# EAGLE design ToggleTone (EAGLE 7.5.0)
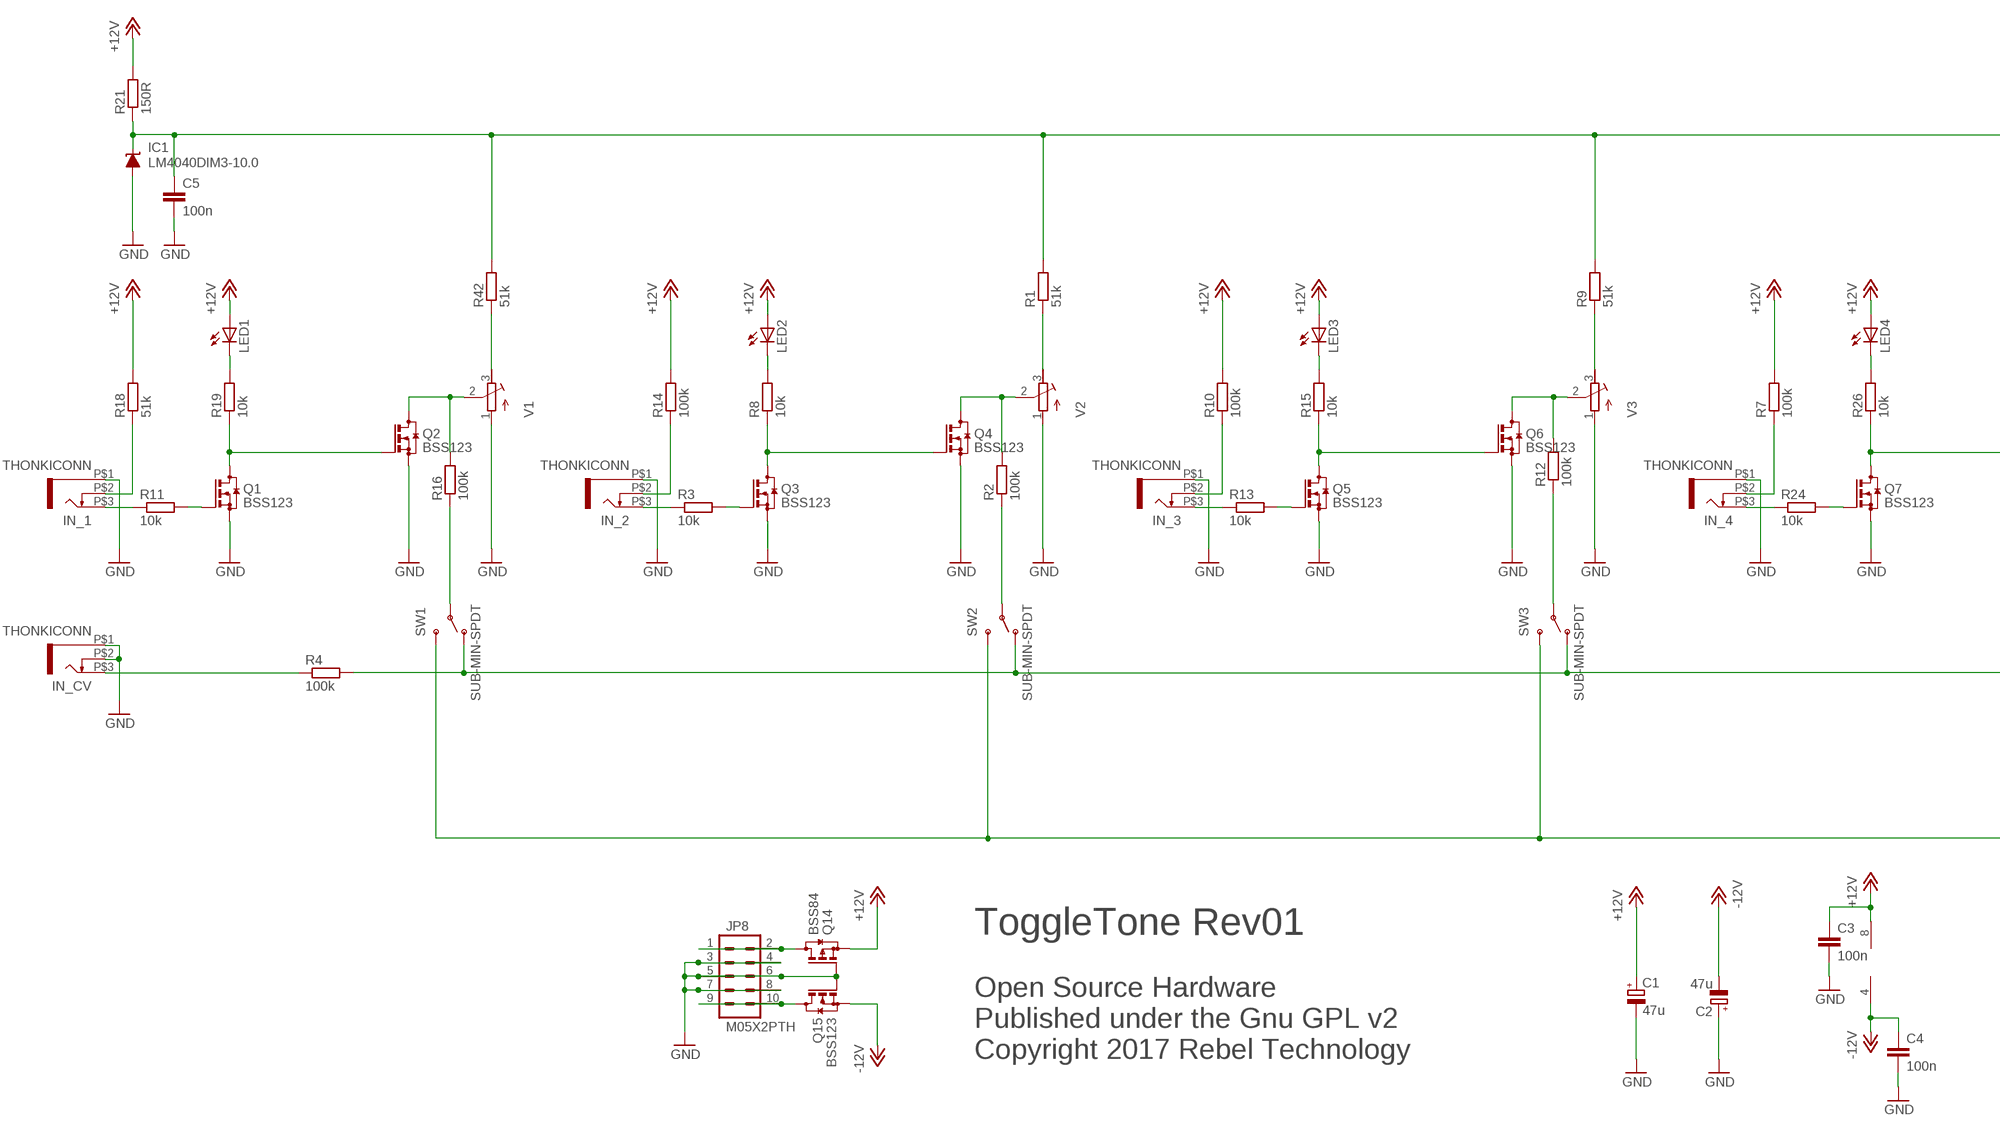
[diagram p0: schematic, sheet 1, part 1 of 2]
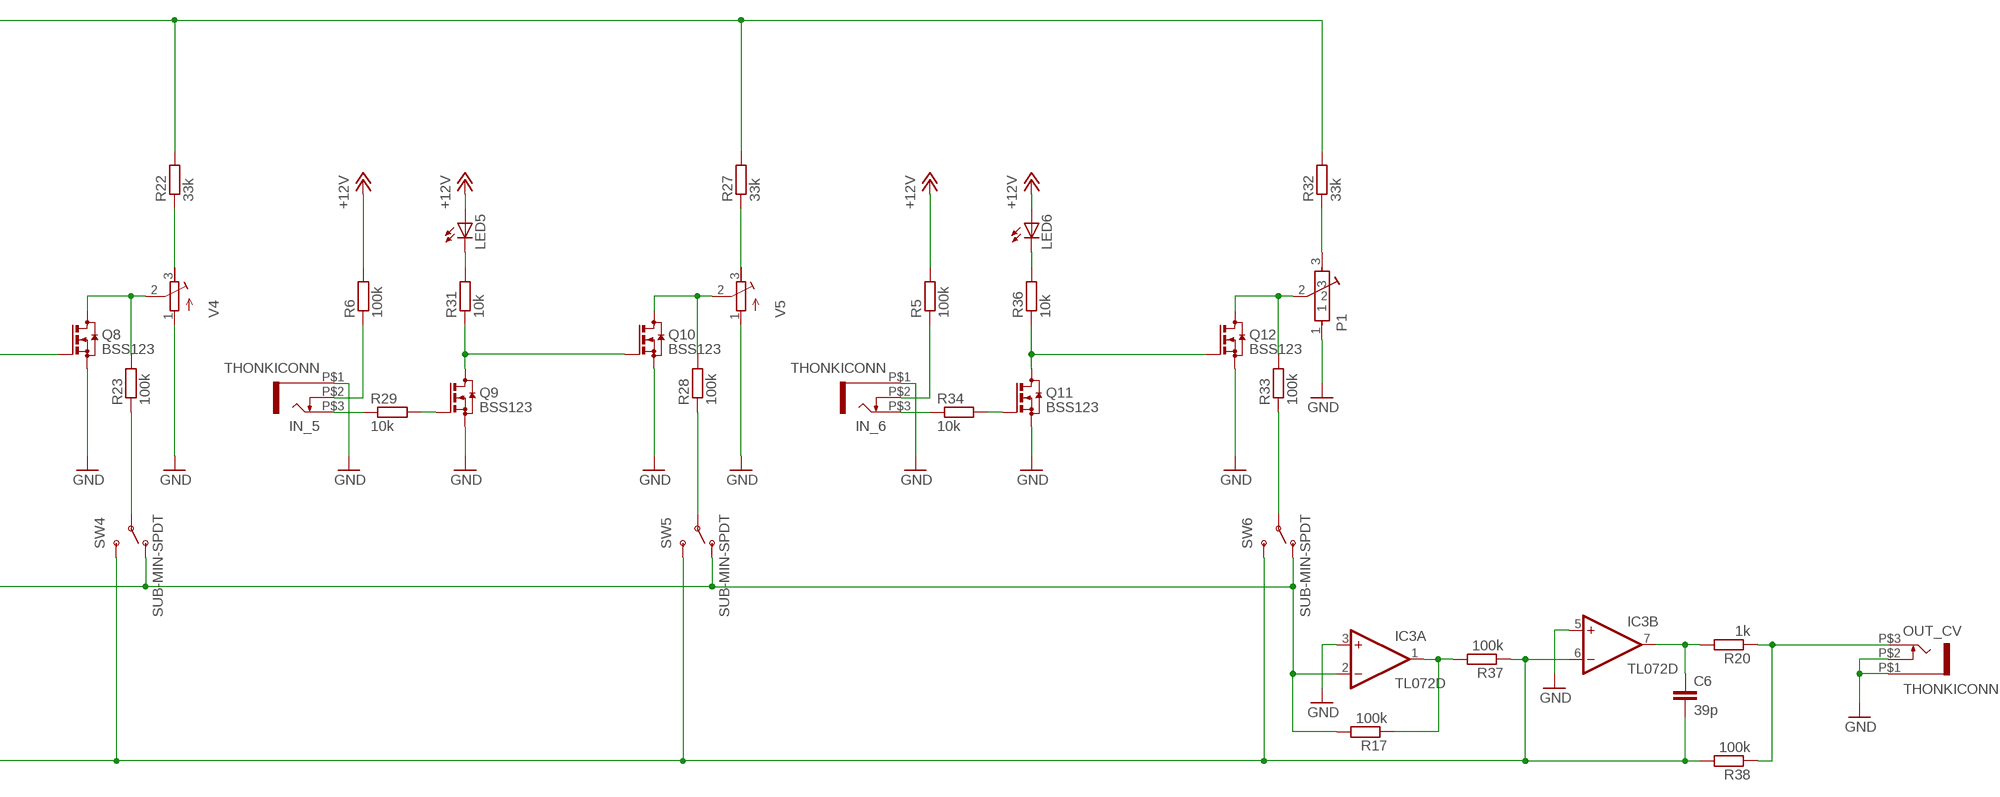
[diagram p1: schematic, sheet 1, part 2 of 2]

## Parts
C1  47u  CPOL-EU153CLV-0505  [CPOL-5]
C2  47u  CPOL-EU153CLV-0505  [CPOL-5]
C3  100n  C-EUC0603  [C0603]
C4  100n  C-EUC0603  [C0603]
C5  100n  C-EUC0603  [C0603]
C6  39p  C-EUC0603  [C0603]
IC1  LM4040DIM3-10.0  LM4041A12DBZ  [DBZ_R-PDSO-G3]
IC3  TL072D  [SO08]
IN_1  THONKICONN  [THONKICONN]
IN_2  THONKICONN  [THONKICONN]
IN_3  THONKICONN  [THONKICONN]
IN_4  THONKICONN  [THONKICONN]
IN_5  THONKICONN  [THONKICONN]
IN_6  THONKICONN  [THONKICONN]
IN_CV  THONKICONN  [THONKICONN]
JP8  M05X2PTH  [AVR_ICSP]
LED1  LED3MM  [LED3MM]
LED2  LED3MM  [LED3MM]
LED3  LED3MM  [LED3MM]
LED4  LED3MM  [LED3MM]
LED5  LED3MM  [LED3MM]
LED6  LED3MM  [LED3MM]
OUT_CV  THONKICONN  [THONKICONN]
P1  POT-ALPS-RK09L1140  [POT-ALPS-RK09L1140]
Q1  BSS123  [SOT23]
Q2  BSS123  [SOT23]
Q3  BSS123  [SOT23]
Q4  BSS123  [SOT23]
Q5  BSS123  [SOT23]
Q6  BSS123  [SOT23]
Q7  BSS123  [SOT23]
Q8  BSS123  [SOT23]
Q9  BSS123  [SOT23]
Q10  BSS123  [SOT23]
Q11  BSS123  [SOT23]
Q12  BSS123  [SOT23]
Q14  BSS84  [SOT23]
Q15  BSS123  [SOT23]
R1  51k  R-EU_0603  [0603]
R2  100k  R-EU_0603  [0603]
R3  10k  R-EU_0603  [0603]
R4  100k  R-EU_0603  [0603]
R5  100k  R-EU_0603  [0603]
R6  100k  R-EU_0603  [0603]
R7  100k  R-EU_0603  [0603]
R8  10k  R-EU_0603  [0603]
R9  51k  R-EU_0603  [0603]
R10  100k  R-EU_0603  [0603]
R11  10k  R-EU_0603  [0603]
R12  100k  R-EU_0603  [0603]
R13  10k  R-EU_0603  [0603]
R14  100k  R-EU_0603  [0603]
R15  10k  R-EU_0603  [0603]
R16  100k  R-EU_0603  [0603]
R17  100k  R-EU_0603  [0603]
R18  51k  R-EU_0603  [0603]
R19  10k  R-EU_0603  [0603]
R20  1k  R-EU_0603  [0603]
R21  150R  R-EU_0603  [0603]
R22  33k  R-EU_0603  [0603]
R23  100k  R-EU_0603  [0603]
R24  10k  R-EU_0603  [0603]
R26  10k  R-EU_0603  [0603]
R27  33k  R-EU_0603  [0603]
R28  100k  R-EU_0603  [0603]
R29  10k  R-EU_0603  [0603]
R31  10k  R-EU_0603  [0603]
R32  33k  R-EU_0603  [0603]
R33  100k  R-EU_0603  [0603]
R34  10k  R-EU_0603  [0603]
R36  10k  R-EU_0603  [0603]
R37  100k  R-EU_0603  [0603]
R38  100k  R-EU_0603  [0603]
R42  51k  R-EU_0603  [0603]
SW1  SUB-MIN-SPDT  [SUB-MIN-SPDT]
SW2  SUB-MIN-SPDT  [SUB-MIN-SPDT]
SW3  SUB-MIN-SPDT  [SUB-MIN-SPDT]
SW4  SUB-MIN-SPDT  [SUB-MIN-SPDT]
SW5  SUB-MIN-SPDT  [SUB-MIN-SPDT]
SW6  SUB-MIN-SPDT  [SUB-MIN-SPDT]
V1  R-TRIMM64W  [RTRIM64W]
V2  R-TRIMM64W  [RTRIM64W]
V3  R-TRIMM64W  [RTRIM64W]
V4  R-TRIMM64W  [RTRIM64W]
V5  R-TRIMM64W  [RTRIM64W]

## Nets
+12V: C1.+ C3.1 IC3.8(P:V+) LED1.A LED2.A LED3.A LED4.A LED5.A LED6.A Q14.2(S) R5.2 R6.2 R7.2 R10.2 R14.2 R18.2 R21.2
-12V: C2.- C4.1 IC3.4(P:V-) Q15.2(S)
GND: C1.- C2.+ C3.2 C4.2 C5.2 IC1.2(A) IC3.3(A:+IN) IC3.5(B:+IN) IN_1.P$1 IN_2.P$1 IN_3.P$1 IN_4.P$1 IN_5.P$1 IN_6.P$1 IN_CV.P$1 IN_CV.P$2 JP8.3 JP8.4 JP8.5 JP8.6 JP8.7 JP8.8 OUT_CV.P$1 OUT_CV.P$2 P1.1 Q1.2(S) Q2.2(S) Q3.2(S) Q4.2(S) Q5.2(S) Q6.2(S) Q7.2(S) Q8.2(S) Q9.2(S) Q10.2(S) Q11.2(S) Q12.2(S) Q14.1(G) Q15.1(G) V1.1(A) V2.1(A) V3.1(A) V4.1(A) V5.1(A)
N$1: LED1.K(C) R19.2
N$2: OUT_CV.P$3 R20.1 R38.1
N$3: IN_1.P$3 R11.1
N$4: JP8.9 JP8.10 Q15.3(D)
N$5: R1.1 V2.3(E)
N$6: IN_CV.P$3 R4.1
N$7: Q2.3(D) R16.2 V1.2(S)
N$8: LED3.K(C) R15.2
N$9: LED4.K(C) R26.2
N$10: LED5.K(C) R31.2
N$11: LED6.K(C) R36.2
N$13: Q3.1(G) R3.2
N$14: LED2.K(C) R8.2
N$15: IN_1.P$2 R18.1
N$16: Q3.3(D) Q4.1(G) R8.1
N$17: IN_2.P$3 R3.1
N$18: Q4.3(D) R2.2 V2.2(S)
N$19: C5.1 IC1.1(C) R1.2 R9.2 R21.1 R22.2 R27.2 R32.2 R42.2
N$20: Q1.1(G) R11.2
N$21: P1.3 R32.1
N$22: IN_6.P$2 R5.1
N$23: R9.1 V3.3(E)
N$24: R12.1 SW3.2(P)
N$25: Q1.3(D) Q2.1(G) R19.1
N$26: Q5.1(G) R13.2
N$27: R16.1 SW1.2(P)
N$28: Q5.3(D) Q6.1(G) R15.1
N$29: IN_3.P$3 R13.1
N$30: Q6.3(D) R12.2 V3.2(S)
N$31: R2.1 SW2.2(P)
N$32: R22.1 V4.3(E)
N$33: C6.1 IC3.7(B:OUT) R20.2
N$34: Q7.1(G) R24.2
N$35: IC3.1(A:OUT) R17.1 R37.2
N$36: R23.1 SW4.2(P)
N$37: Q7.3(D) Q8.1(G) R26.1
N$38: IN_4.P$3 R24.1
N$39: Q8.3(D) R23.2 V4.2(S)
N$40: R28.1 SW5.2(P)
N$41: R33.1 SW6.2(P)
N$42: IN_5.P$2 R6.1
N$43: R27.1 V5.3(E)
N$44: R42.1 V1.3(E)
N$45: Q9.1(G) R29.2
N$46: Q9.3(D) Q10.1(G) R31.1
N$47: IN_2.P$2 R14.1
N$49: IN_5.P$3 R29.1
N$50: Q10.3(D) R28.2 V5.2(S)
N$51: IN_3.P$2 R10.1
N$52: Q11.1(G) R34.2
N$53: IN_4.P$2 R7.1
N$54: Q11.3(D) Q12.1(G) R36.1
N$55: IN_6.P$3 R34.1
N$56: P1.2 Q12.3(D) R33.2
N$79: JP8.1 JP8.2 Q14.3(D)
NEG: C6.2 IC3.6(B:-IN) R37.1 R38.2 SW1.3(S) SW2.3(S) SW3.3(S) SW4.3(S) SW5.3(S) SW6.3(S)
POS: IC3.2(A:-IN) R4.2 R17.2 SW1.1(O) SW2.1(O) SW3.1(O) SW4.1(O) SW5.1(O) SW6.1(O)
Unconnected: P1.P$5 P1.P$6

## Notes on the sheet
- ToggleTone Rev01
- Open Source Hardware
  Published under the Gnu GPL v2
  Copyright 2017 Rebel Technology

## Library data of the parts
C1 C2 = Rebel:CPOL-EU: POLARIZED CAPACITOR, European symbol
C3-C6 = Rebel:C-EU: CAPACITOR, European symbol
IC1 = texas:LM4041: PRECISION MICROPOWER SHUNT VOLTAGE REFERENCE Source: http://focus.ti.com/lit/ds/slcs146e/slcs146e.pdf; MPN: LM4041A12IDBZR; OC_FARNELL: 1407949; OC_NEWARK: 58K5875
IC3 = linear:TL072: OP AMP
IN_1-IN_6 IN_CV OUT_CV = Rebel:THONKICONN
JP8 = SparkFun:M05X2: Header 5x2 Standard 10-pin dual row 0.1" header. Commonly used with AVR-ISP. Use with Spark Fun Electronics SKU: PRT-00778
LED1-LED6 = Rebel:LED: LED
P1 = Rebel:POT-ALPS-RK09L
Q1-Q12 = transistor-small-signal:BSS123: N-CHANNEL MOS FET
Q14 = transistor-small-signal:BSS84: P-CHANNEL MOS FET; OC_FARNELL: 1779264
Q15 = transistor-small-signal:BSS123: N-CHANNEL MOS FET; OC_FARNELL: 1843725
R1-R24 R26-R29 R31-R34 R36-R38 R42 = Rebel:R-EU_: RESISTOR, European symbol
SW1-SW6 = Rebel:SUB-MIN-SPDT
V1-V5 = resistor:R-TRIMM: Trimm resistor

## Module TRIGGER
Ports: TR_IN(io)

### Library data of the parts

## Board
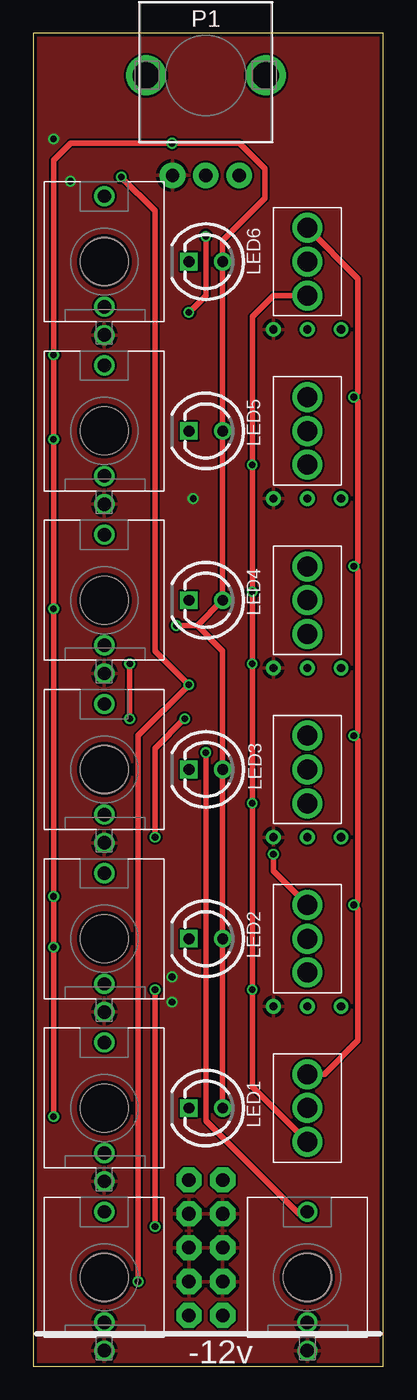
[diagram p2: board, top side]
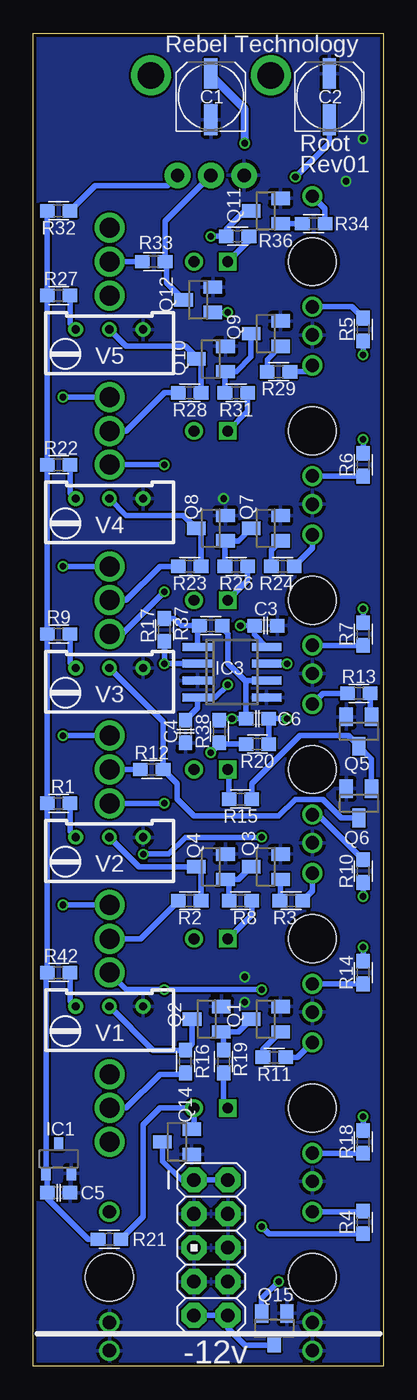
[diagram p3: board, bottom side, seen from below]

Size 26.29 x 100 mm. Coordinates in mm from the lower left corner, seen from the top.
Outline: 26.29,0 26.29,100 0,100 0,0 26.29,0
Copper layers (1*16): Top 0.035mm / dielectric 1.5mm / Bottom 0.035mm
Design rules "SeeedStudio_2layer_DRU_no_angle_20140221": minimum track width 6mil, minimum drill 12mil, track to track 6mil, track to pad 6mil, pad to pad 6mil, via to via 6mil, smd to smd 0mil, copper to edge 10mil, drill to drill 10mil, minimum pad ring 10mil, minimum via ring 6mil, stop-mask expansion 2mil, vias tented up to drill 100mil, thermal gap 10mil

### Footprints (pad centres in the part's own frame; a part is rotated, then mirrored left to right if it is on the bottom)
CPOL-5 = smd 2.3 x 1: + 1.725,0; - -1.725,0
C0603 = smd 1.1 x 1: 1 -0.85,0; 2 0.85,0
DBZ_R-PDSO-G3 = smd 0.7 x 1: 1 -0.95,-1.1; 2 0.95,-1.1; 3 0,1.1
SO08 = smd 0.6 x 2.2: 1 -1.905,-2.6; 2 -0.635,-2.6; 3 0.635,-2.6; 4 1.905,-2.6; 5 1.905,2.6; 6 0.635,2.6; 7 -0.635,2.6; 8 -1.905,2.6
THONKICONN = drill 1: P$1 0,-5.5; P$2 0,-3.38; P$3 0,4.92 | hole 3.6: 0,0
AVR_ICSP = drill 1.016 pad 1.88 octagon: 1 -1.27,5.08; 2 1.27,5.08; 3 -1.27,2.54; 4 1.27,2.54; 5 -1.27,0; 6 1.27,0; 7 -1.27,-2.54; 8 1.27,-2.54; 9 -1.27,-5.08; 10 1.27,-5.08
LED3MM = drill 0.813: A -1.27,0 | drill 0.813 square: K 1.27,0
POT-ALPS-RK09L1140 = drill 1 pad 1.93: 1 -2.5,-7.5; 2 0,-7.5; 3 2.5,-7.5 | drill 2: P$5 -4.5,0; P$6 4.5,0
SOT23 = smd 1 x 1.4: 1 -0.95,-1.1; 2 0.95,-1.1; 3 0,1.1
0603 = smd 1.1 x 1: 1 -0.85,0; 2 0.85,0
SUB-MIN-SPDT = drill 1.5: 1 0,-2.54; 2 0,0; 3 0,2.54
RTRIM64W = drill 0.61: 1 1.27,-2.54; 2 1.27,0; 3 1.27,2.54

### Placement (x,y rotation side)
C1  12.95,95.25 90 bottom
C2  4.06,95.25 90 bottom
C3  8.83,55.56 0 bottom
C4  14.86,47.62 270 bottom
C5  24.38,13.02 0 bottom
C6  9.46,48.58 180 bottom
IC1  24.38,15.56 0 bottom
IC3  11.37,52.07 270 bottom
IN_1  5.33,19.37 0 top
IN_2  5.33,32.07 0 top
IN_3  5.33,44.77 0 top
IN_4  5.33,57.47 0 top
IN_5  5.33,70.17 0 top
IN_6  5.33,82.87 0 top
IN_CV  5.33,6.67 0 top
JP8  12.95,8.89 0 bottom
LED1  12.95,19.37 180 top
LED2  12.95,32.07 180 top
LED3  12.95,44.77 180 top
LED4  12.95,57.47 180 top
LED5  12.95,70.17 180 top
LED6  12.95,82.87 180 top
OUT_CV  20.57,6.67 0 top
P1  12.95,96.84 0 top
Q1  8.83,26.04 90 bottom
Q2  13.27,26.04 90 bottom
Q3  8.83,37.46 90 bottom
Q4  12.95,37.46 90 bottom
Q5  1.84,47.62 180 bottom
Q6  1.84,42.23 180 bottom
Q7  8.83,62.87 90 bottom
Q8  12.95,62.87 90 bottom
Q9  8.83,77.47 90 bottom
Q10  12.95,75.56 90 bottom
Q11  8.83,86.67 90 bottom
Q12  13.91,80.01 90 bottom
Q14  15.49,16.83 90 bottom
Q15  8.19,2.86 180 bottom
R1  24.38,42.23 180 bottom
R2  14.54,34.92 0 bottom
R3  6.92,34.92 180 bottom
R4  1.52,10.79 270 bottom
R5  1.52,77.79 270 bottom
R6  1.52,67.63 90 bottom
R7  1.52,54.93 90 bottom
R8  1k  [0603]  10.73,34.92 0 bottom
R9  24.38,54.93 180 bottom
R10  1.52,37.15 270 bottom
R11  8.19,23.18 180 bottom
R12  17.4,44.77 0 bottom
R13  1.84,50.48 0 bottom
R14  1.52,29.53 90 bottom
R15  1k  [0603]  10.73,42.55 180 bottom
R16  14.86,22.86 90 bottom
R17  16.45,55.24 270 bottom
R18  1.52,16.83 90 bottom
R19  1k  [0603]  12,22.86 270 bottom
R20  9.46,46.67 0 bottom
R21  20.57,9.52 0 bottom
R22  24.38,67.63 180 bottom
R23  14.54,60.01 0 bottom
R24  7.56,60.01 180 bottom
R26  1k  [0603]  11.05,60.01 0 bottom
R27  24.38,80.33 180 bottom
R28  14.54,73.03 0 bottom
R29  7.87,74.61 180 bottom
R31  1k  [0603]  11.05,73.03 0 bottom
R32  24.38,86.68 180 bottom
R33  17.24,82.87 0 bottom
R34  5.23,85.72 180 bottom
R36  1k  [0603]  10.95,84.77 0 bottom
R37  12.95,55.56 180 bottom
R38  12.32,47.62 90 bottom
R42  24.38,29.53 180 bottom
SW1  20.57,19.37 0 top
SW2  20.57,32.07 0 top
SW3  20.57,44.77 0 top
SW4  20.57,57.47 0 top
SW5  20.57,70.17 0 top
SW6  20.57,82.87 0 top
V1  20.57,25.72 90 bottom
V2  20.57,38.42 90 bottom
V3  20.57,51.12 90 bottom
V4  20.57,63.82 90 bottom
V5  20.57,76.52 90 bottom

### Tracks (layer width: path | path; a pad name or v marks a point on that pad's centre or on a via)
+12V  (via drill 0.5)
  Top 0.406: LED1.A LED2.A LED3.A 14.22,53.66 12.32,55.56 | v10.73,55.56 12.32,55.56 | 12.32,55.56 LED4.A LED5.A LED6.A 14.22,84.45 17.4,87.63 17.4,89.85 16.76,90.49 15.49,91.76 v10.41,91.76 2.79,91.76 1.52,90.49 v1.52,75.88 v1.52,69.53 v1.52,56.83 1.52,41.27 v1.52,35.24 v1.52,31.43 v1.52,18.73
  Bottom 0.406: IC3.8 9.68,54.88 C3.1 v10.73,55.56 | Q14.2 14.22,17.95 LED1.A 16.76,19.37 18.03,18.1 18.03,11.22 R21.2 | v1.52,75.88 R5.2 | R6.2 v1.52,69.53 | R7.2 v1.52,56.83 | v1.52,35.24 R10.2 | R14.2 v1.52,31.43 | R18.2 v1.52,18.73
  Bottom 0.61: v10.41,91.76 10.41,94.3 12.95,96.84 C1.+
-12V  (via drill 0.5)
  Top 0.406: v7.87,6.35 7.87,47.31 v11.68,51.12 9.14,53.66 9.14,86.68 v6.6,89.22
  Bottom 0.406: C4.1 13.97,49.37 IC3.4 12.64,50.16 v11.68,51.12 | 6.6,89.24 v6.6,89.22 5.33,90.49 4.48,91.34 4.06,91.76 C2.- | Q15.2 9.14,5.08 v7.87,6.35
GND  (via drill 0.5)
  other vias: 2.79,88.9 1.52,92.08 10.41,29.21 12,65.09 10.41,27.3
  pour Bottom: -2.29,-1.59 28.19,-1.59 28.19,101.28 -2.29,101.28
  pour Top: -3.56,-1.59 29.46,-1.59 29.46,101.28 -3.56,101.28
N$1
  Bottom 0.406: R19.2 12,19.68 LED1.K
N$2  (via drill 0.5)
  Top 0.406: v12.95,46.04 12.95,18.41 19.94,11.43 20.42,11.43 OUT_CV.P$3
  Bottom 0.406: R20.1 12.22,46.67 R38.1 12.32,46.67 v12.95,46.04
N$3
  Bottom 0.406: R11.1 6.44,23.18 IN_1.P$3
N$4
  Bottom 0.406: Q15.3 8.36,1.59 10.41,1.59 11.68,2.86 JP8.10 JP8.9
N$5
  Bottom 0.406: R1.1 23.53,40.11 V2.3
N$6
  Bottom 0.406: IN_CV.P$3 1.9,11.59 R4.1
N$7
  Bottom 0.406: Q2.3 14.37,24.2 R16.2 17.3,23.71 V1.2
N$8
  Bottom 0.406: R15.2 11.58,44.66 LED3.K
N$9
  Bottom 0.406: R26.2 10.2,58.95 LED4.K
N$10
  Bottom 0.406: R31.2 10.2,71.65 LED5.K
N$11
  Bottom 0.406: R36.2 10.1,84.45 LED6.K
N$13
  Bottom 0.406: Q3.1 7.73,34.97 R3.2
N$14
  Bottom 0.406: R8.2 9.88,33.87 LED2.K
N$15
  Bottom 0.406: IN_1.P$2 R18.1
N$16
  Bottom 0.406: Q3.3 10.88,36.52 Q4.1 11.58,36.24 R8.1
N$17
  Bottom 0.406: IN_2.P$3 5.33,35.66 R3.1
N$18
  Bottom 0.406: R2.2 13.69,37.1 Q4.3 18.35,37.46 V2.2
N$19
  Bottom 0.406: R21.1 22.16,9.52 25.23,12.6 C5.1 25.23,14.04 IC1.1 25.33,29.43 R42.2 R1.2 R9.2 R22.2 R27.2 R32.2
N$20
  Bottom 0.406: R11.2 9.04,23.77 Q1.1
N$21
  Bottom 0.406: P1.3 16.21,88.58 20.57,88.58 21.63,88.58 R32.1
N$22
  Bottom 0.406: IN_6.P$2 2.37,79.49 R5.1
N$23
  Bottom 0.406: R9.1 23.53,52.81 V3.3
N$24
  Bottom 0.406: SW3.2 R12.1
N$25
  Bottom 0.406: Q2.1 11.68,25.09 | 11.68,25.09 10.88,25.09 Q1.3 | R19.1 12,24.77 11.68,25.09
N$26
  Bottom 0.406: R13.2 0.99,48.83 Q5.1
N$27
  Bottom 0.406: SW1.2 19.3,19.37 16.76,21.91 14.96,21.91 R16.1
N$28
  Bottom 0.406: R15.1 9.88,43.71 6.29,47.31 2.62,47.31 Q5.3 0.89,45.58 Q6.1
N$29
  Bottom 0.406: R13.1 4.54,50.48 IN_3.P$3
N$30
  Bottom 0.406: Q6.3 3.15,41.13 4.53,42.51 6.6,42.51 7.87,41.27 14.22,41.27 15.49,42.55 15.49,43.71 R12.2 16.55,48.36 V3.2
N$31
  Bottom 0.406: SW2.2 18.25,32.07 R2.1
N$32
  Bottom 0.406: R22.1 23.53,65.51 V4.3
N$33  (via drill 0.5)
  Top 0.406: v7.24,52.7 v7.24,48.58
  Bottom 0.406: IC3.7 v7.24,52.7 | v7.24,48.58 C6.1 R20.2
N$34
  Bottom 0.406: R24.2 8.41,61.24 Q7.1
N$35
  Bottom 0.406: IC3.1 13.97,55.4 R37.2 15.18,55.56 15.71,56.09 R17.1
N$36
  Bottom 0.406: SW4.2 19.3,57.47 16.76,60.01 R23.1
N$37
  Bottom 0.406: Q7.3 10.88,61.91 Q8.1 11.9,61.87 R26.1
N$38
  Bottom 0.406: IN_4.P$3 5.33,61.38 R24.1
N$39
  Bottom 0.406: R23.2 13.69,62.5 Q8.3 15.01,63.82 19.3,63.82 V4.2
N$40
  Bottom 0.406: SW5.2 19.3,70.17 16.45,73.03 R28.1
N$41
  Bottom 0.406: SW6.2 R33.1
N$42
  Bottom 0.406: IN_5.P$2 R6.1
N$43
  Bottom 0.406: R27.1 23.53,78.21 V5.3
N$44
  Bottom 0.406: R42.1 23.53,27.41 V1.3
N$45
  Bottom 0.406: R29.2 8.72,75.52 Q9.1
N$46
  Bottom 0.406: R31.1 11.9,74.57 Q10.1 11.05,74.61 9.93,75.74 Q9.3
N$47
  Bottom 0.406: IN_2.P$2 R14.1
N$49
  Bottom 0.406: R29.1 5.81,74.61 IN_5.P$3
N$50
  Bottom 0.406: R28.2 13.69,75.2 Q10.3 14.22,75.74 14.22,75.88 14.86,76.52 19.3,76.52 V5.2
N$51
  Bottom 0.406: IN_3.P$2 4.91,41.39 R10.1
N$52
  Bottom 0.406: R34.2 Q11.1
N$53
  Bottom 0.406: IN_4.P$2 R7.1
N$54  (via drill 0.5)
  Top 0.406: v12.95,84.77 12.95,80.33 v11.68,79.06
  Bottom 0.406: Q12.1 v11.68,79.06 | Q11.3 10.42,86.67 11.8,85.3 R36.1 v12.95,84.77
N$55
  Bottom 0.406: R34.1 4.38,86.83 IN_6.P$3
N$56
  Bottom 0.406: Q12.3 16.29,81.28 16.29,82.77 R33.2 16.39,85.9 P1.2
N$79
  Bottom 0.406: JP8.2 JP8.1 15.18,13.97 16.59,15.39 Q14.3
NEG  (via drill 0.5)
  Top 0.406: v9.14,39.69 9.14,46.35 v11.37,48.58 | v18.03,38.42 18.03,37.15 SW2.3 | SW1.3 21.84,21.91 24.38,24.45 24.38,34.29 v24.07,34.61 24.38,34.92 24.38,46.99 v24.07,47.31 24.38,47.63 24.38,59.69 v24.07,60.01 24.38,60.33 24.38,72.39 v24.07,72.71 24.38,73.03 24.38,81.6 SW6.3
  Bottom 0.406: R37.1 12.1,55.35 11.68,54.93 11.68,52.7 10.41,51.44 | IC3.6 10.41,51.44 | 10.41,51.44 10.31,51.33 C6.2 v11.37,48.58 12.22,48.58 R38.2 | v9.14,39.69 14.86,39.69 16.13,38.42 v18.03,38.42 | SW5.3 v24.07,72.71 | SW4.3 v24.07,60.01 | SW3.3 v24.07,47.31 | SW2.3 v24.07,34.61
POS  (via drill 0.5)
  Top 0.406: SW6.1 18.03,80.33 16.45,78.74 v16.45,67.63 v16.45,58.1 v16.45,52.7 v16.45,42.23 v16.45,28.26 16.45,20.95 SW1.1 | v9.14,10.48 v9.14,28.26
  Bottom 0.406: R17.2 v16.45,52.7 IC3.2 | v16.45,67.63 SW5.1 | v16.45,58.1 19.62,54.93 SW4.1 | SW3.1 v16.45,42.23 | SW2.1 19.3,28.26 v16.45,28.26 v9.14,28.26 | R4.2 8.61,9.95 v9.14,10.48

### Text on the board
tPlace: -12v
bPlace: Rebel Technology | Root | Rev01 | -12v